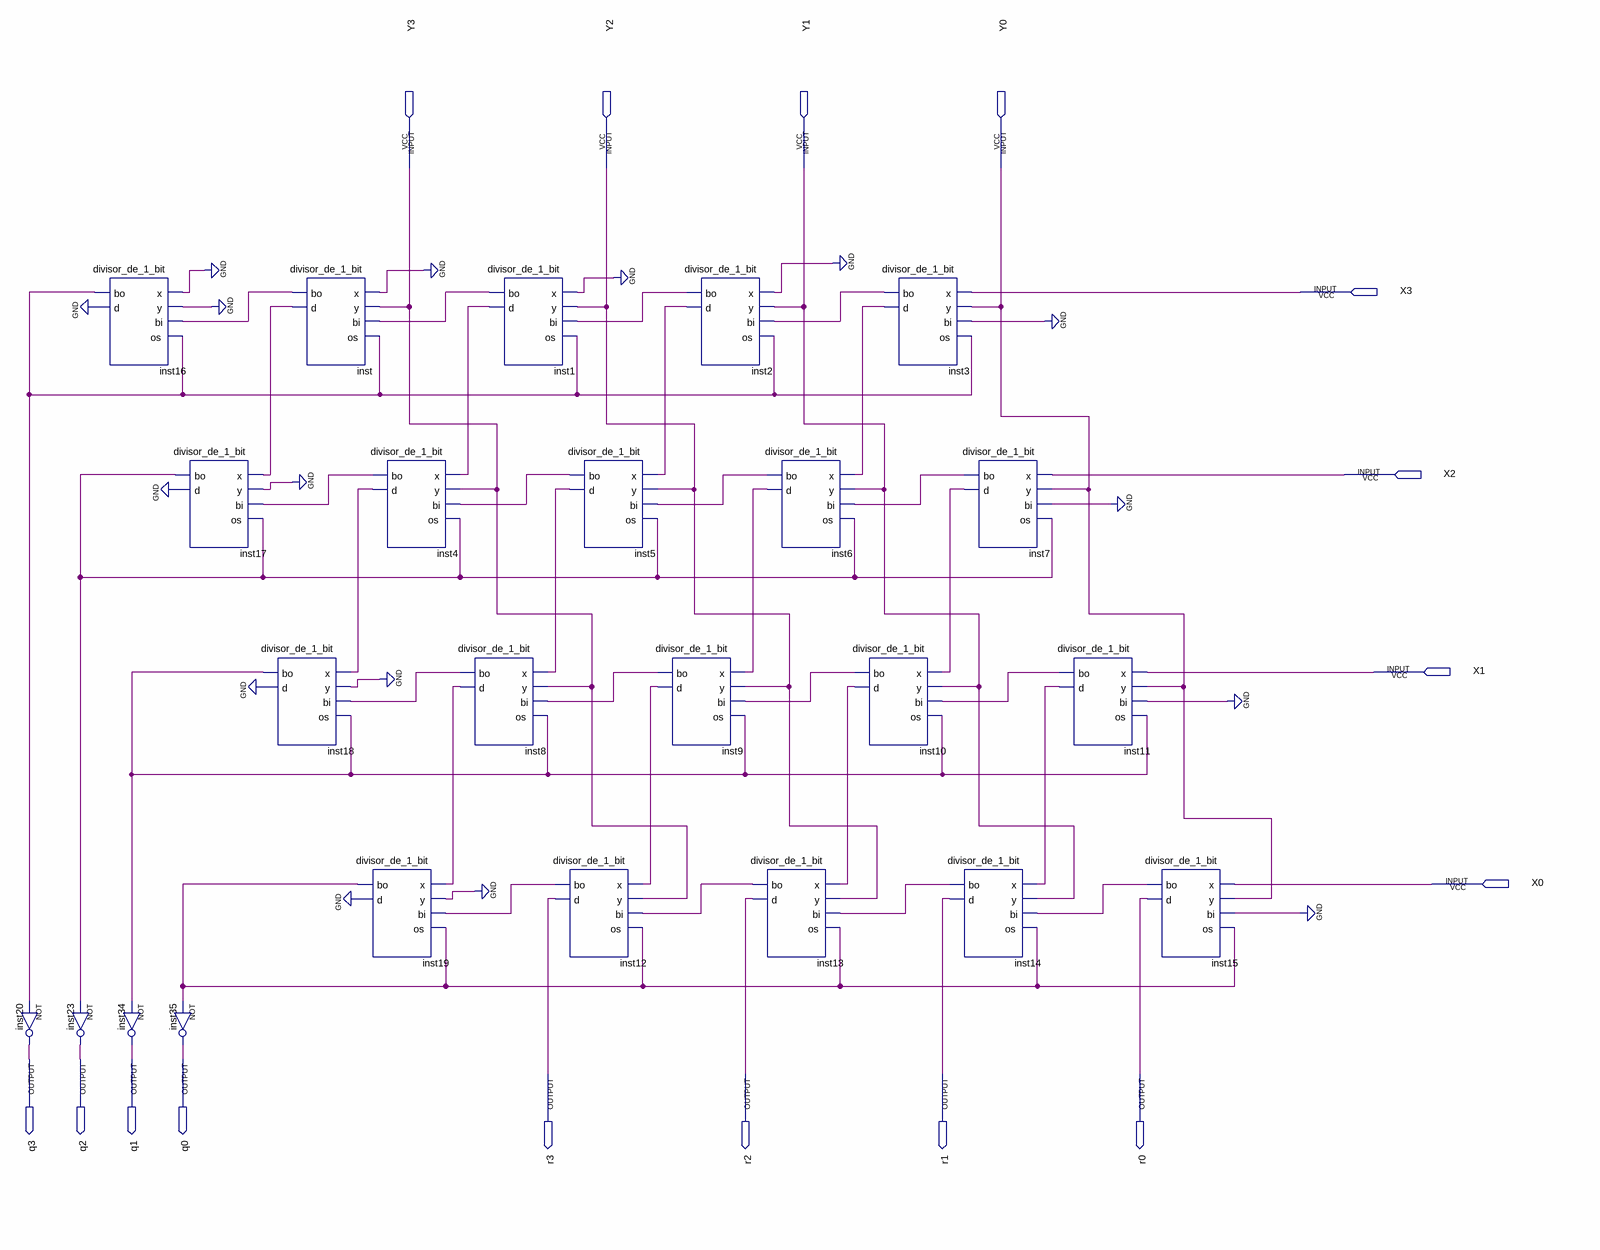
[diagram p0: schematic sheet]
// Quartus schematic divisor4bits.bdf as structural Verilog: 24 symbols, 16 pins
module divisor4bits (
  input  Y3,
  input  Y2,
  input  Y1,
  input  Y0,
  input  X3,
  input  X2,
  input  X1,
  input  X0,
  output q3,
  output q2,
  output q1,
  output q0,
  output r3,
  output r2,
  output r1,
  output r0
);

  wire inst1_bo, inst1_d, inst2_bo, inst2_d, inst3_bo, inst3_d, inst4_bo, inst4_d, inst5_bo, inst5_d,
       inst6_bo, inst6_d, inst7_bo, inst7_d, inst8_bo, inst8_d, inst9_bo, inst9_d, inst10_bo, inst10_d,
       inst11_bo, inst11_d, inst12_bo, inst13_bo, inst14_bo, inst15_bo, inst16_bo, inst16_d, inst17_bo,
       inst17_d, inst18_bo, inst18_d, inst19_bo, inst19_d, inst_bo, inst_d;

  not inst20 (q3, inst16_bo);
  not inst23 (q2, inst17_bo);
  divisor_de_1_bit inst16 (.x(1'b0), .y(1'b0), .bi(inst_bo), .os(inst16_bo), .bo(inst16_bo), .d(inst16_d));
  not inst34 (q1, inst18_bo);
  divisor_de_1_bit inst17 (.x(inst_d), .y(1'b0), .bi(inst4_bo), .os(inst17_bo), .bo(inst17_bo), .d(inst17_d));
  not inst35 (q0, inst19_bo);
  divisor_de_1_bit inst (.x(1'b0), .y(Y3), .bi(inst1_bo), .os(inst16_bo), .bo(inst_bo), .d(inst_d));
  divisor_de_1_bit inst18 (.x(inst4_d), .y(1'b0), .bi(inst8_bo), .os(inst18_bo), .bo(inst18_bo), .d(inst18_d));
  divisor_de_1_bit inst19 (.x(inst8_d), .y(1'b0), .bi(inst12_bo), .os(inst19_bo), .bo(inst19_bo), .d(inst19_d));
  divisor_de_1_bit inst4 (.x(inst1_d), .y(Y3), .bi(inst5_bo), .os(inst17_bo), .bo(inst4_bo), .d(inst4_d));
  divisor_de_1_bit inst8 (.x(inst5_d), .y(Y3), .bi(inst9_bo), .os(inst18_bo), .bo(inst8_bo), .d(inst8_d));
  divisor_de_1_bit inst1 (.x(1'b0), .y(Y2), .bi(inst2_bo), .os(inst16_bo), .bo(inst1_bo), .d(inst1_d));
  divisor_de_1_bit inst5 (.x(inst2_d), .y(Y2), .bi(inst6_bo), .os(inst17_bo), .bo(inst5_bo), .d(inst5_d));
  divisor_de_1_bit inst12 (.x(inst9_d), .y(Y3), .bi(inst13_bo), .os(inst19_bo), .bo(inst12_bo), .d(r3));
  divisor_de_1_bit inst9 (.x(inst6_d), .y(Y2), .bi(inst10_bo), .os(inst18_bo), .bo(inst9_bo), .d(inst9_d));
  divisor_de_1_bit inst2 (.x(1'b0), .y(Y1), .bi(inst3_bo), .os(inst16_bo), .bo(inst2_bo), .d(inst2_d));
  divisor_de_1_bit inst6 (.x(inst3_d), .y(Y1), .bi(inst7_bo), .os(inst17_bo), .bo(inst6_bo), .d(inst6_d));
  divisor_de_1_bit inst13 (.x(inst10_d), .y(Y2), .bi(inst14_bo), .os(inst19_bo), .bo(inst13_bo), .d(r2));
  divisor_de_1_bit inst3 (.x(X3), .y(Y0), .bi(1'b0), .os(inst16_bo), .bo(inst3_bo), .d(inst3_d));
  divisor_de_1_bit inst10 (.x(inst7_d), .y(Y1), .bi(inst11_bo), .os(inst18_bo), .bo(inst10_bo), .d(inst10_d));
  divisor_de_1_bit inst14 (.x(inst11_d), .y(Y1), .bi(inst15_bo), .os(inst19_bo), .bo(inst14_bo), .d(r1));
  divisor_de_1_bit inst7 (.x(X2), .y(Y0), .bi(1'b0), .os(inst17_bo), .bo(inst7_bo), .d(inst7_d));
  divisor_de_1_bit inst11 (.x(X1), .y(Y0), .bi(1'b0), .os(inst18_bo), .bo(inst11_bo), .d(inst11_d));
  divisor_de_1_bit inst15 (.x(X0), .y(Y0), .bi(1'b0), .os(inst19_bo), .bo(inst15_bo), .d(r0));
  // also tied to GND on the sheet: {inst16_d, inst17_d, inst18_d, inst19_d}
endmodule
